# Altium schematic sheet TX_custom.SchDoc
size A2
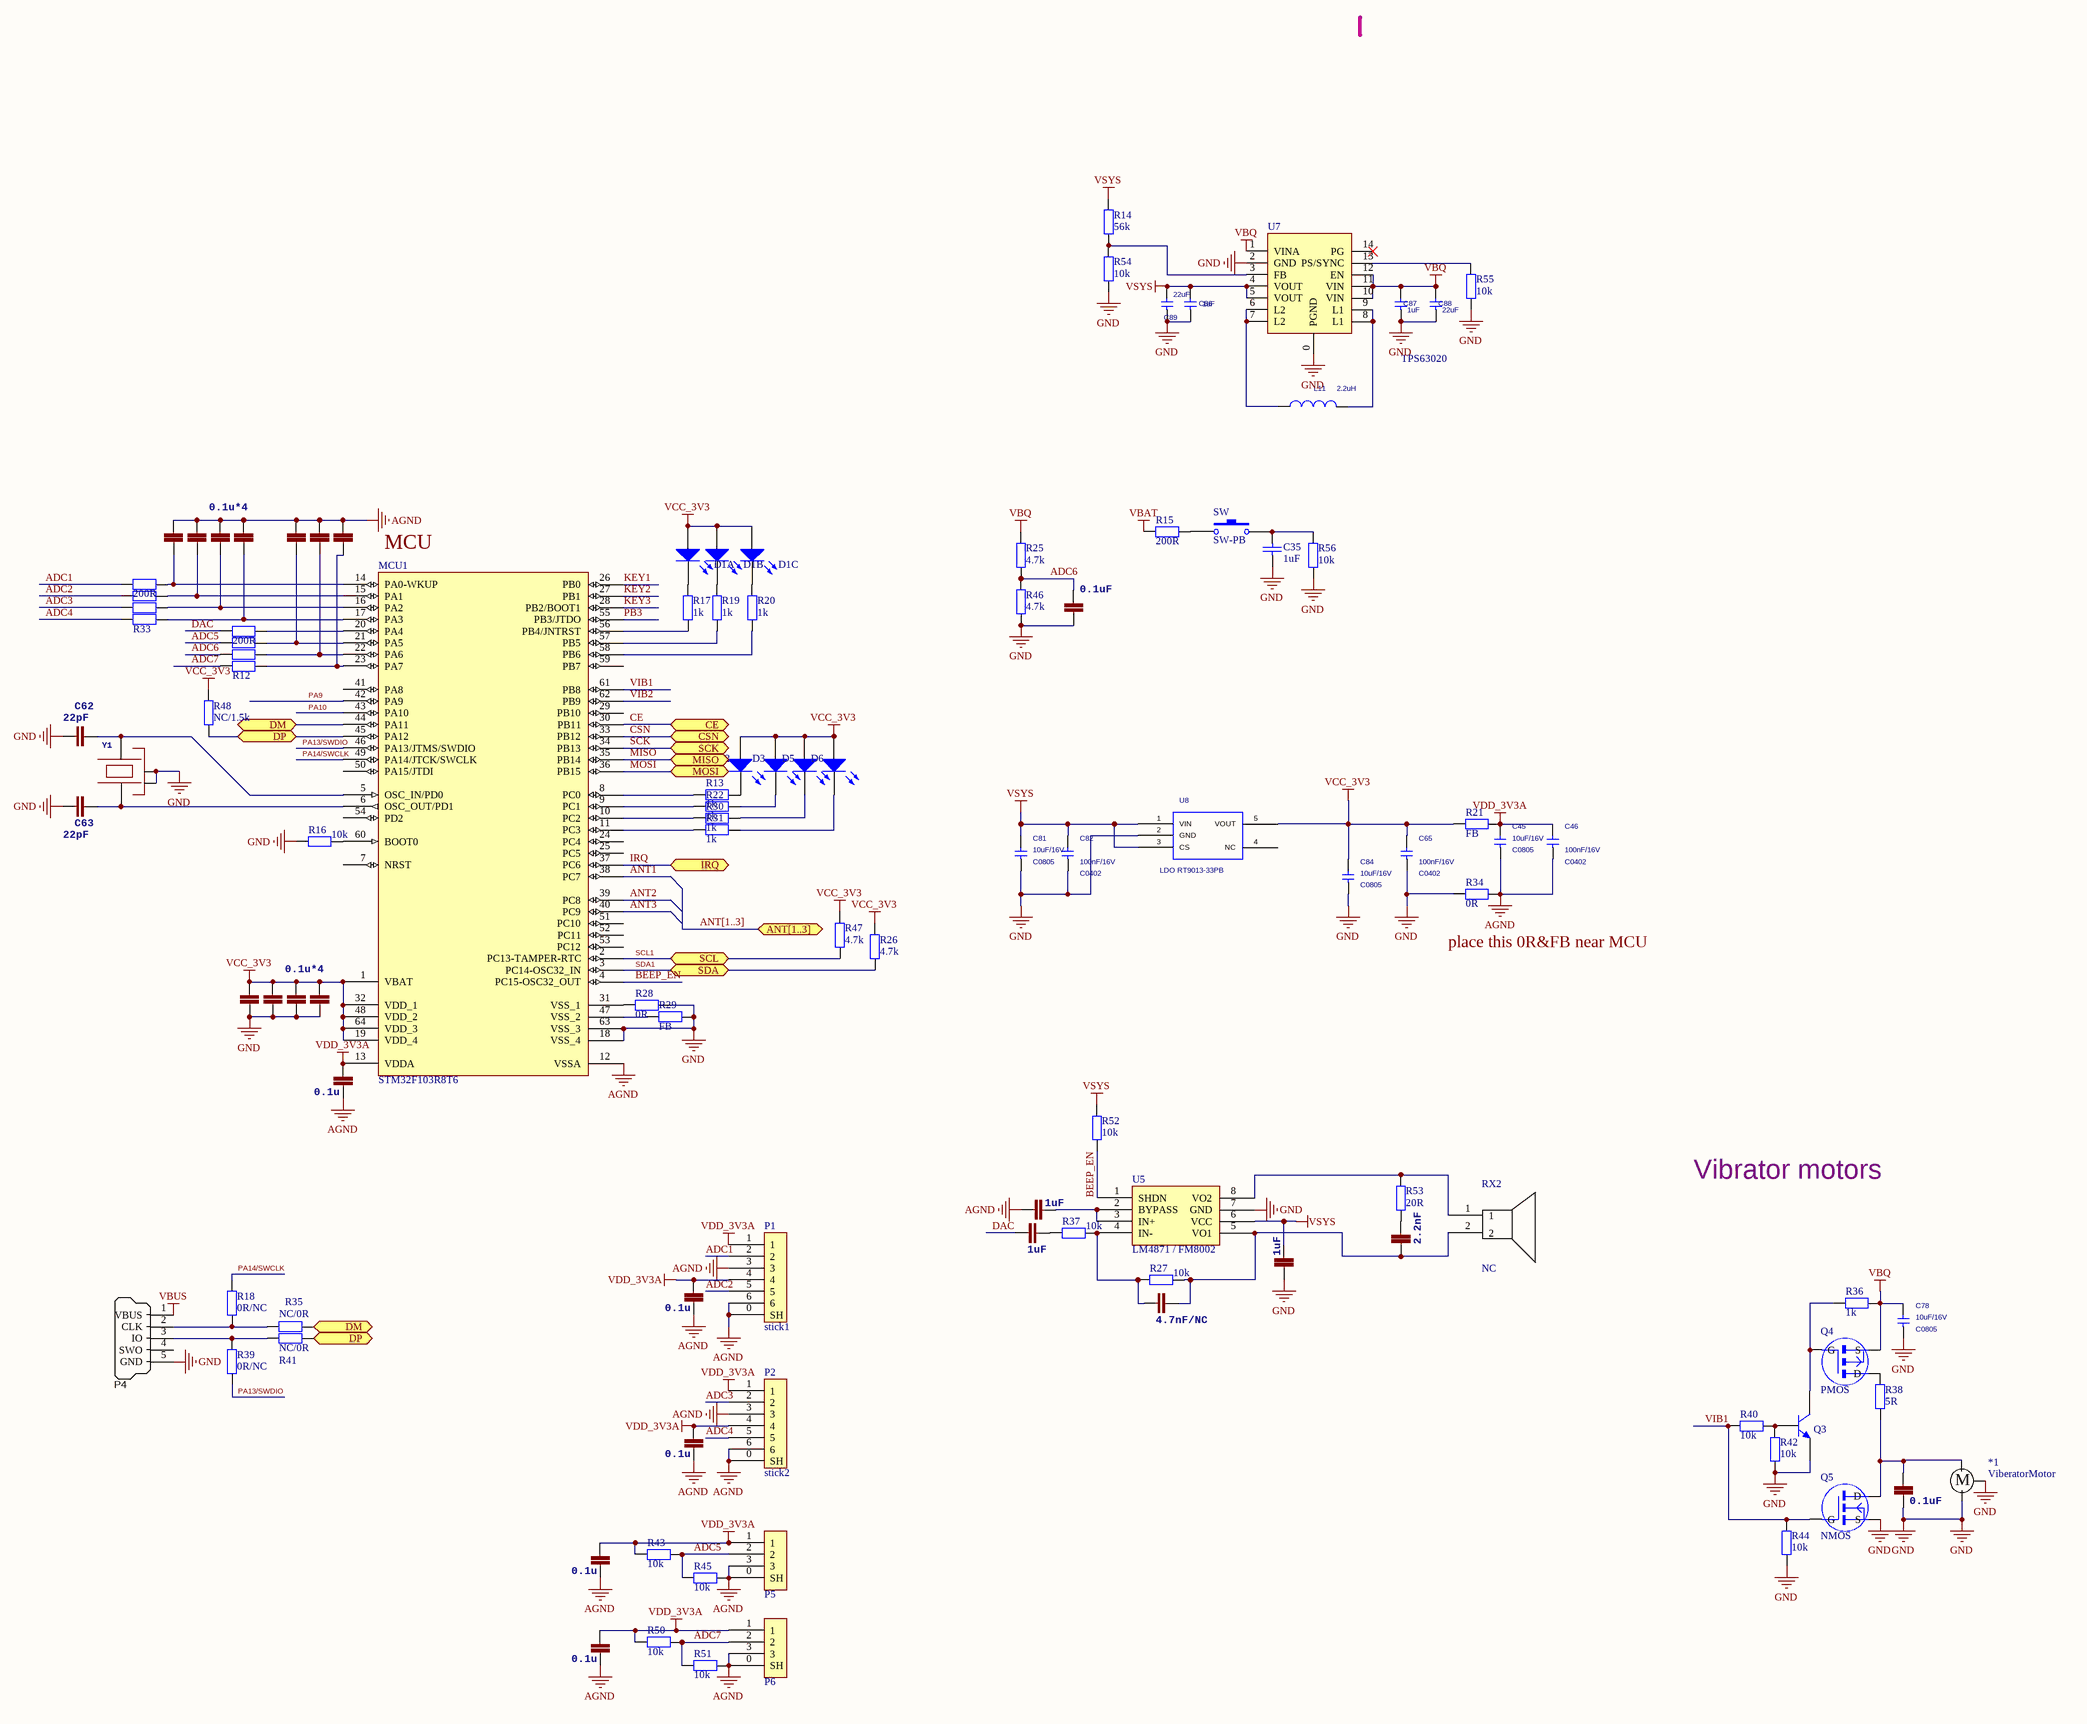
[diagram p0: TX_custom.SchDoc]

## Parts
*1  ViberatorMotor  [VibratorMotor]
C35  1uF  [0402]
C37  0.1uF  [0603]
C45  value 10uF/16V  PCB DECAL: C0805  [0805]  (hidden comment: C)
C46  value 100nF/16V  PCB DECAL: C0402  [0603]  (hidden comment: C)
C54  0.1u*4  [0402]
C55  1n  [0402]  (value not drawn)
C56  1n  [0402]  (value not drawn)
C57  1n  [0402]  (value not drawn)
C58  1n  [0402]  (value not drawn)
C59  1n  [0402]  (value not drawn)
C60  1n  [0402]  (value not drawn)
C61  0.1uF  [0402]
C62  22pF  [0402]
C63  22pF  [0402]
C65  value 100nF/16V  PCB DECAL: C0402  [0603]  (hidden comment: C)
C67  0.1u*4  [0402]
C68  1n  [0402]  (value not drawn)
C69  1n  [0402]  (value not drawn)
C70  1n  [0402]  (value not drawn)
C71  0.1u  [0402]
C72  1uF  [0603]
C73  1uF  [0603]
C74  2.2nF  [0402]
C75  1uF  [0603]
C76  4.7nF/NC  [0402]
C77  0.1u  [0402]
C78  value 10uF/16V  PCB DECAL: C0805  [0805]  (hidden comment: C)
C79  0.1u  [0402]
C80  0.1u  [0402]
C81  value 10uF/16V  PCB DECAL: C0805  [0805]  (hidden comment: C)
C82  value 100nF/16V  PCB DECAL: C0402  [0603]  (hidden comment: C)
C83  0.1u  [0402]
C84  value 10uF/16V  PCB DECAL: C0805  [0805]  (hidden comment: C)
C86  1uF  [0805]
C87  1uF  [0805]
C88  22uF  [0805]
C89  22uF  [0805]
D1  LEDx3  [LC-0603_Rx2]  (value not drawn)  (parts A,B,C of 3)
D2  LED0  [0603LED]  (value not drawn)
D3  LED0  [0603LED]  (value not drawn)
D5  LED0  [0603LED]  (value not drawn)
D6  LED0  [0603LED]  (value not drawn)
L11  2.2uH  [L3015]
MCU1  STM32F103R8T6  [LQFP64_N]
P1  stick1  [WFRSM125 - 6P]
P2  stick2  [WFRSM125 - 6P]
P4  SWD_MicroUSB  [MICRO-YZX]  (value not drawn)
P5  3PSocket_T  [WFRSM125 - 3P]  (value not drawn)
P6  3PSocket_T  [WFRSM125 - 3P]  (value not drawn)
Q3  NPN  [SOT-23B_L]  (value not drawn)
Q4  PMOS  [SOT-23B_L]
Q5  NMOS  [SOT-23B_L]
R12  200R  [0402X4]
R13  1k  [0402]
R14  56k  [0402]
R15  200R  [0402]
R16  10k  [0402]
R17  1k  [0402]
R18  0R/NC  [0402]
R19  1k  [0402]
R20  1k  [0402]
R21  FB  [0402]
R22  1k  [0402]
R25  4.7k  [0402]
R26  4.7k  [0402]
R27  10k  [0402]
R28  0R  [0402]
R29  FB  [0402]
R30  1k  [0402]
R31  1k  [0402]
R33  200R  [0402X4]
R34  0R  [0402]
R35  NC/0R  [0402]
R36  1k  [0402]
R37  10k  [0402]
R38  5R  [0603]
R39  0R/NC  [0402]
R40  10k  [0402]
R41  NC/0R  [0402]
R42  10k  [0402]
R43  10k  [0402]
R44  10k  [0402]
R45  10k  [0402]
R46  4.7k  [0402]
R47  4.7k  [0402]
R48  NC/1.5k  [0402]
R50  10k  [0402]
R51  10k  [0402]
R52  10k  [0402]
R53  20R  [0402]
R54  10k  [0402]
R55  10k  [0402]
R56  10k  [0402]
RX2  NC  [sonar-10mm]
SW  SW-PB  [SW3x4]
U5  LM4871 / FM8002  [SOIC8_39MM]
U7  TPS63020  [TPS63020]
U8  value LDO RT9013-33PB  [SOT23-5]  (hidden comment: RT9193-33_1_2)
Y1  16Mhz  [OSCILLATOR-3.2X2.5]  (value not drawn)

## Ports
ANT[1..3], CE, CSN, DM, DP, IRQ, MISO, MOSI, SCK, SCL, SDA

## Nets
AGND: C45.2 C46.2 C54.2 C55.2 C56.2 C57.2 C58.2 C59.2 C60.2 C71.1 C72.2 C77.1 C79.1 C80.1 C83.1 MCU1.12(VSSA) P1.0(SH) P1.3 P1.6 P2.0(SH) P2.3 P2.6 P5.0(SH) P5.3 P6.0(SH) P6.3 R34.1 R45.2 R51.2
GND: *1.0 *1.2 C35.2 C37.2 C61.1 C62.2 C63.2 C65.2 C67.1 C68.1 C69.1 C70.1 C75.2 C78.2 C81.2 C82.2 C84.2 C86.2 C87.2 C88.2 C89.2 MCU1.18(VSS_4) MCU1.63(VSS_3) P4.5(GND) Q3.2(E) Q5.S R16.1 R28.1 R29.1 R34.2 R42.1 R44.1 R46.1 R54.2 R55.2 R56.1 U5.7(GND) U7.0(PGND) U7.2(GND) U8.2(GND) Y1.2(NC_2) Y1.4(NC_4)
VBAT: R15.1
VBQ: C78.1 C87.1 C88.1 Q4.S R25.2 R36.1 U7.1(VINA) U7.10(VIN) U7.11(VIN) U7.12(EN)
VBUS: P4.1(VBUS)
VCC_3V3: C65.1 C67.2 C68.2 C69.2 C70.2 C84.1 D1.1(A) D2.1(A) D3.1(A) D5.1(A) D6.1(A) MCU1.1(VBAT) MCU1.19(VDD_4) MCU1.32(VDD_1) MCU1.48(VDD_2) MCU1.64(VDD_3) R21.2 R26.2 R47.2 R48.2 U8.5(VOUT)
VDD_3V3A: C45.1 C46.1 C71.2 C77.2 C79.2 C80.2 C83.2 MCU1.13(VDDA) P1.1 P1.4 P2.1 P2.4 P5.1 P6.1 R21.1 R43.1 R50.1
VSYS: C75.1 C81.1 C82.1 C86.1 C89.1 R14.1 R52.2 U5.6(VCC) U7.4(VOUT) U7.5(VOUT) U8.1(VIN) U8.3(CS)
ADC1: P1.2 R33.1
ADC2: P1.5 R33.2
ADC3: P2.2 R33.3
ADC4: P2.5 R33.4
ADC5: P5.2 R12.2 R43.2 R45.1
ADC6: C61.2 R12.3 R25.1 R46.2
ADC7: P6.2 R12.4 R50.2 R51.1
ANT1: MCU1.38(PC7)
ANT2: MCU1.39(PC8)
ANT3: MCU1.40(PC9)
BEEP_EN: MCU1.4(PC15-OSC32_OUT) R52.1 U5.1(SHDN)
CE: MCU1.30(PB11) ; port CE
CSN: MCU1.33(PB12) ; port CSN
DAC: C73.2 R12.1
DM: MCU1.44(PA11) R35.1 ; port DM
DP: MCU1.45(PA12) R41.1 R48.1 ; port DP
IRQ: MCU1.37(PC6) ; port IRQ
KEY1: MCU1.26(PB0)
KEY2: MCU1.27(PB1)
KEY3: MCU1.28(PB2/BOOT1)
MISO: MCU1.35(PB14) ; port MISO
MOSI: MCU1.36(PB15) ; port MOSI
PA9: MCU1.42(PA9)
PA10: MCU1.43(PA10)
PA13/SWDIO: MCU1.46(PA13/JTMS/SWDIO) R39.2
PA14/SWCLK: MCU1.49(PA14/JTCK/SWCLK) R18.1
PB3: MCU1.55(PB3/JTDO)
SCK: MCU1.34(PB13) ; port SCK
SCL1: MCU1.2(PC13-TAMPER-RTC) R47.1 ; port SCL
SDA1: MCU1.3(PC14-OSC32_IN) R26.1 ; port SDA
VIB1: MCU1.61(PB8) Q5.G R40.2 R44.2
VIB2: MCU1.62(PB9)
Net*1_1: *1.1 C37.1 Q5.D R38.1
NetC35_1: C35.1 R56.2 SW.2
NetC54_1: C54.1 MCU1.14(PA0-WKUP) R33.8
NetC55_1: C55.1 MCU1.15(PA1) R33.7
NetC56_1: C56.1 MCU1.16(PA2) R33.6
NetC57_1: C57.1 MCU1.17(PA3) R33.5
NetC58_1: C58.1 MCU1.21(PA5) R12.7
NetC59_1: C59.1 MCU1.22(PA6) R12.6
NetC60_1: C60.1 MCU1.23(PA7) R12.5
NetC62_1: C62.1 MCU1.5(OSC_IN/PD0) Y1.3
NetC63_1: C63.1 MCU1.6(OSC_OUT/PD1) Y1.1
NetC72_1: C72.1 U5.2(BYPASS) U5.3(IN+)
NetC73_1: C73.1 R37.1
NetC74_1: C74.1 R53.1
NetC74_2: C74.2 C76.1 R27.2 RX2.2 U5.5(VO1)
NetC76_2: C76.2 R27.1 R37.2 U5.4(IN-)
NetD1_2: D1.2(K) R17.2
NetD1_3: D1.3(K) R19.2
NetD1_4: D1.4(K) R20.2
NetD2_2: D2.2(K) R13.1
NetD3_2: D3.2(K) R22.1
NetD5_2: D5.2(K) R30.1
NetD6_2: D6.2(K) R31.1
NetL11_1: L11.1 U7.8(L1) U7.9(L1)
NetL11_2: L11.2 U7.6(L2) U7.7(L2)
NetMCU1_8: MCU1.8(PC0) R13.2
NetMCU1_9: MCU1.9(PC1) R22.2
NetMCU1_10: MCU1.10(PC2) R30.2
NetMCU1_11: MCU1.11(PC3) R31.2
NetMCU1_20: MCU1.20(PA4) R12.8
NetMCU1_31: MCU1.31(VSS_1) R28.2
NetMCU1_47: MCU1.47(VSS_2) R29.2
NetMCU1_56: MCU1.56(PB4/JNTRST) R17.1
NetMCU1_57: MCU1.57(PB5) R19.1
NetMCU1_58: MCU1.58(PB6) R20.1
NetMCU1_60: MCU1.60(BOOT0) R16.2
NetP4_2: P4.2(CLK) R18.2 R35.2
NetP4_3: P4.3(IO) R39.1 R41.2
NetQ3_1: Q3.1(B) R40.1 R42.2
NetQ3_3: Q3.3(C) Q4.G R36.2
NetQ4_D: Q4.D R38.2
NetR14_2: R14.2 R54.1 U7.3(FB)
NetR15_2: R15.2 SW.1
NetR53_2: R53.2 RX2.1 U5.8(VO2)
NetR55_1: R55.1 U7.13(PS/SYNC)

Not connected (* = marked no-connect by the designer): MCU1 7(NRST) 24(PC4) 25(PC5) 29(PB10) 41(PA8) 50(PA15/JTDI) 51(PC10) 52(PC11) 53(PC12) 54(PD2) 59(PB7); P4 4(SWO); U7 14(PG)*; U8 4(NC)

## Buses and harness runs
bus ANT[1..3] = port ANT[1..3]

## Notes on the sheet
- MCU
- (near R34) place this 0R&FB near MCU
- Vibrator motors
- (in symbol ViberatorMotor) M

## Library data of the parts
C35 = Cap: Capacitor; Published: 8-Jun-2000; LatestRevisionDate: 17-Jul-2002; LatestRevisionNote: Re-released for DXP Platform.; PackageReference: RAD-0.3; Publisher: Altium Limited; PackageDescription: Radial Cap, Thru-Hole; 2 Leads; 0.3 in Pin Spacing
C37 C54-C63 C67-C77 C79 C80 C83 = CAP0402-CAP: <b>Capacitor</b> / Standard 0603 ceramic capacitor, and 0.1" leaded capacitor.; PARTNO: CC0402ZRY5V7BB104
C45 C46 C65 C78 C81 C82 C84 = C: Source_Path: C:\USERS\EULER-SJ\DESKTOP\CHEN-PI2\LIBRARY1.OLB; PSpiceTemplate: C^@REFDES %1 %2 ?TOLERANCE|C^@REFDES| @VALUE ?IC/IC=@IC/ ?TOLERANCE|\n.model C^@REFDES CAP C=1 DEV=@TOLERANCE%|
C86-C89 = C: PCB DECAL: C0805; Source_Path: C:\USERS\EULER-SJ\DESKTOP\CHEN-PI2\LIBRARY1.OLB; Value: 10uF/16V; PSpiceTemplate: C^@REFDES %1 %2 ?TOLERANCE|C^@REFDES| @VALUE ?IC/IC=@IC/ ?TOLERANCE|\n.model C^@REFDES CAP C=1 DEV=@TOLERANCE%|
D1 = LEDx3: Typical RED GaAs LED; Published: 8-Jun-2000; LatestRevisionDate: 08-Jul-2005; LatestRevisionNote: Mech Layer 1 removed.; PackageReference: LED-1; Publisher: Altium Limited; PackageDescription: LED; 2 Leads
D2 D3 D5 D6 = LED0: Typical INFRARED GaAs LED; Published: 8-Jun-2000; LatestRevisionDate: 08-Jul-2005; LatestRevisionNote: Mech Layer 1 removed.; PackageReference: LED-0; Publisher: Altium Limited; PackageDescription: LED; 2 Leads
L11 = INDUCTOR: PCB DECAL: LC7066CN; Source_Path: C:\PROGRAM FILES\ORCAD\CAPTURE\LIBRARY\DISCRETE.OLB; Value: 4.7uH
MCU1 = STM32F103R8T6: STM32 ARM-based 32-bit MCU with 64 Kbytes Flash, 64-pin LQFP, Industrial Temperature; Published: *; DatasheetVersion: *; PackageVersion: *; PackageReference: *; Publisher: *; PackageDescription: *; ComponentLink1Description: *; ComponentLink1URL: *; ComponentLink2Description: *; ComponentLink2URL: *
P1 P2 = 6PSocket_T
P4 = SWD_MicroUSB: Connector SMD USB Micro Type B middle mount; Manufacturer 1: Molex Inc; SCDType: undef; Package / Case: SMD; Supplier 1: Digi-Key; Supplier Part Number 1: WM17142CT-ND
Q3 = NPN: NPN Bipolar Transistor; Published: 8-Jun-2000; LatestRevisionDate: 29-May-2009; LatestRevisionNote: IPC-7351 Footprint Added.; PackageVersion: Aug-1999; PackageReference: SOT-23B; Publisher: Altium Limited; PackageDescription: 3-Pin SOT-23 Package 0.95 mm Pitch, 2.4 mm Lead Span
Q4 = PMOS: pin to pad: D>3 G>1 S>2
Q5 = NMOS: pin to pad: D>3 G>1 S>2
R12 R33 = Res*4: Resistor; Value: 0Ohm; Published: 8-Jun-2000; LatestRevisionDate: 17-Jul-2002; LatestRevisionNote: Re-released for DXP Platform.; PackageReference: AXIAL-0.4; Publisher: Altium Limited; PackageDescription: Axial Device, Thru-Hole; 2 Leads; 0.4 in Pin Spacing
R13 R16-R20 R22 R27 R30 R31 R35 R37 R39 R41 R43 R45 R50-R53 = Res2: Resistor; Value: 0Ohm; Published: 8-Jun-2000; LatestRevisionDate: 17-Jul-2002; LatestRevisionNote: Re-released for DXP Platform.; PackageReference: AXIAL-0.4; Publisher: Altium Limited; PackageDescription: Axial Device, Thru-Hole; 2 Leads; 0.4 in Pin Spacing
R14 R15 R21 R28 R29 R34 R36 R40 R44 R54-R56 = Res2: Resistor; Published: 8-Jun-2000; LatestRevisionDate: 17-Jul-2002; LatestRevisionNote: Re-released for DXP Platform.; PackageReference: AXIAL-0.4; Publisher: Altium Limited; PackageDescription: Axial Device, Thru-Hole; 2 Leads; 0.4 in Pin Spacing
R25 R26 R38 R42 R46-R48 = Res2: Resistor; Value: 22k 1%; Published: 8-Jun-2000; LatestRevisionDate: 17-Jul-2002; LatestRevisionNote: Re-released for DXP Platform.; PackageReference: AXIAL-0.4; Publisher: Altium Limited; PackageDescription: Axial Device, Thru-Hole; 2 Leads; 0.4 in Pin Spacing
RX2 = sonar
SW = SW-PB: Switch; Published: 24-Mar-1999; LatestRevisionDate: 17-Jul-2002; LatestRevisionNote: Re-released for DXP Platform.; PackageReference: SPST-2; Publisher: Altium Limited; PackageDescription: Switch; 2 Leads
U5 = LM4871
U8 = RT9193-33_1_2: Part_No_: 1; Source_Path: W:\PROJECT\JOVI\NT96650\REFERENCE CIRCUIT\NT96650ES_PANA34110.DSN; PCB DECAL: SOT23-5
Y1 = OSCILLATOR-3.2X2.5: Crystal Oscillator in 3.2x2.5 SMD